# EAGLE schematic Attiny85_BT-Relay (EAGLE 6.4)
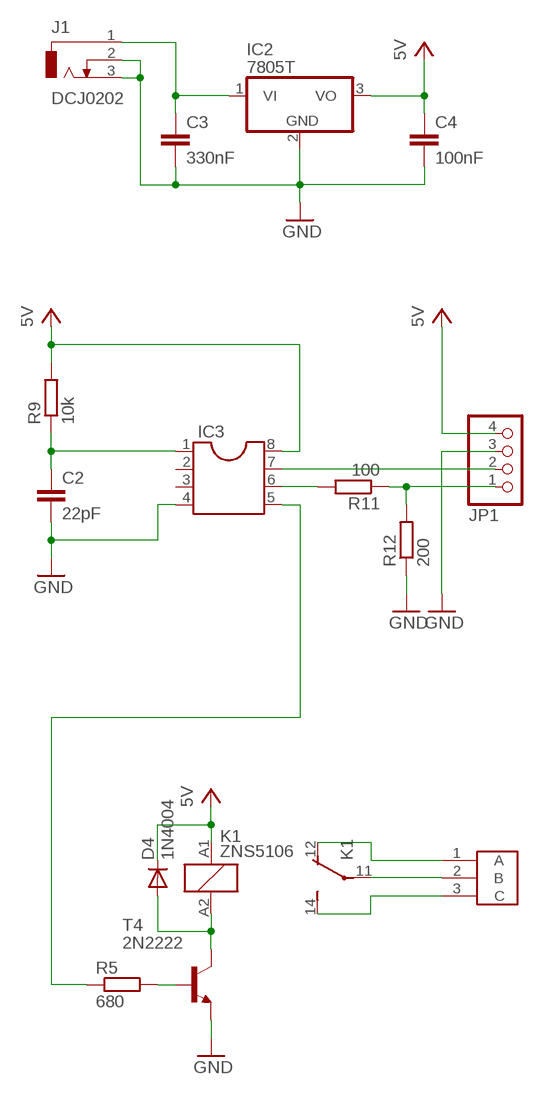
[diagram p0: schematic, sheet 1]

## Parts
C2  22pF  C-EU050-025X075  [C050-025X075]
C3  330nF  C-EU050-025X075  [C050-025X075]
C4  100nF  C-EU050-025X075  [C050-025X075]
D4  1N4004  [DO41-10]
IC2  7805T  [TO220H]
IC3  DIL8S  [SOCKET-08]
J1  DCJ0202  [DCJ0202]
JP1  PINHD-1X4  [1X04]
K1  ZNS5106  [ZN5]
R5  680  R-EU_0204/7  [0204/7]
R9  10k  R-EU_0204/7  [0204/7]
R11  100  R-EU_0204/7  [0204/7]
R12  200  R-EU_0204/7  [0204/7]
T4  2N2222  [TO18]
U$1  POT_CONNECTOR  [POT_CONNECTOR]

## Nets
GND: C2.2 C3.2 C4.2 IC2.2(GND) IC3.4 J1.2 J1.3 JP1.3 R12.1 T4.1(E)
N$1: IC3.7 JP1.2
N$2: K1.11(2:P) U$1.2(B)
N$3: IC3.6 R11.2
N$4: K1.12(2:O) U$1.1(A)
N$5: K1.14(2:S) U$1.3(C)
N$6: D4.A K1.A2 T4.3(C)
N$16: R5.2 T4.2(B)
N$27: C2.1 IC3.1 R9.1
N$30: C3.1 IC2.1(VI) J1.1
N$36: JP1.1 R11.1 R12.2
N$44: IC3.5 R5.1
VCC: C4.1 D4.C IC2.3(VO) IC3.8 JP1.4 K1.A1 R9.2 ; supply symbol labelled 5V
Unconnected: IC3.2 IC3.3

## Library data of the parts
C2-C4 = rcl:C-EU: CAPACITOR, European symbol
D4 = diode:1N4004: DIODE general purpose rectifier, 1 A
IC2 = linear:78*: Positive VOLTAGE REGULATOR Source: http://cache.national.com/ds/LM/LM78L05.pdf http://www.fairchildsemi.com/ds/LM/LM7805.pdf
IC3 = ic-package:DIL8: Dual In Line / Socket
J1 = con-jack:DCJ0202: DC POWER JACK Source: DCJ0202.pdf; OC_FARNELL: unknown; OC_NEWARK: unknown
JP1 = pinhead:PINHD-1X4: PIN HEADER
K1 = relay:ZNS5*: Miniature Power PCB Relay SCHRACK 1pole 10 A Source: http://www.schrack.com/.. 5847.pdf; OC_FARNELL: unknown; OC_NEWARK: unknown
R5 R9 R11 R12 = rcl:R-EU_: RESISTOR, European symbol
T4 = transistor:2N2222: NPN TRANSISTOR
U$1 = mi_lib:POT_CONNECTOR: Conector de potencia de 3 terminales